# EAGLE design rk86-kbd (EAGLE 7.7.0)
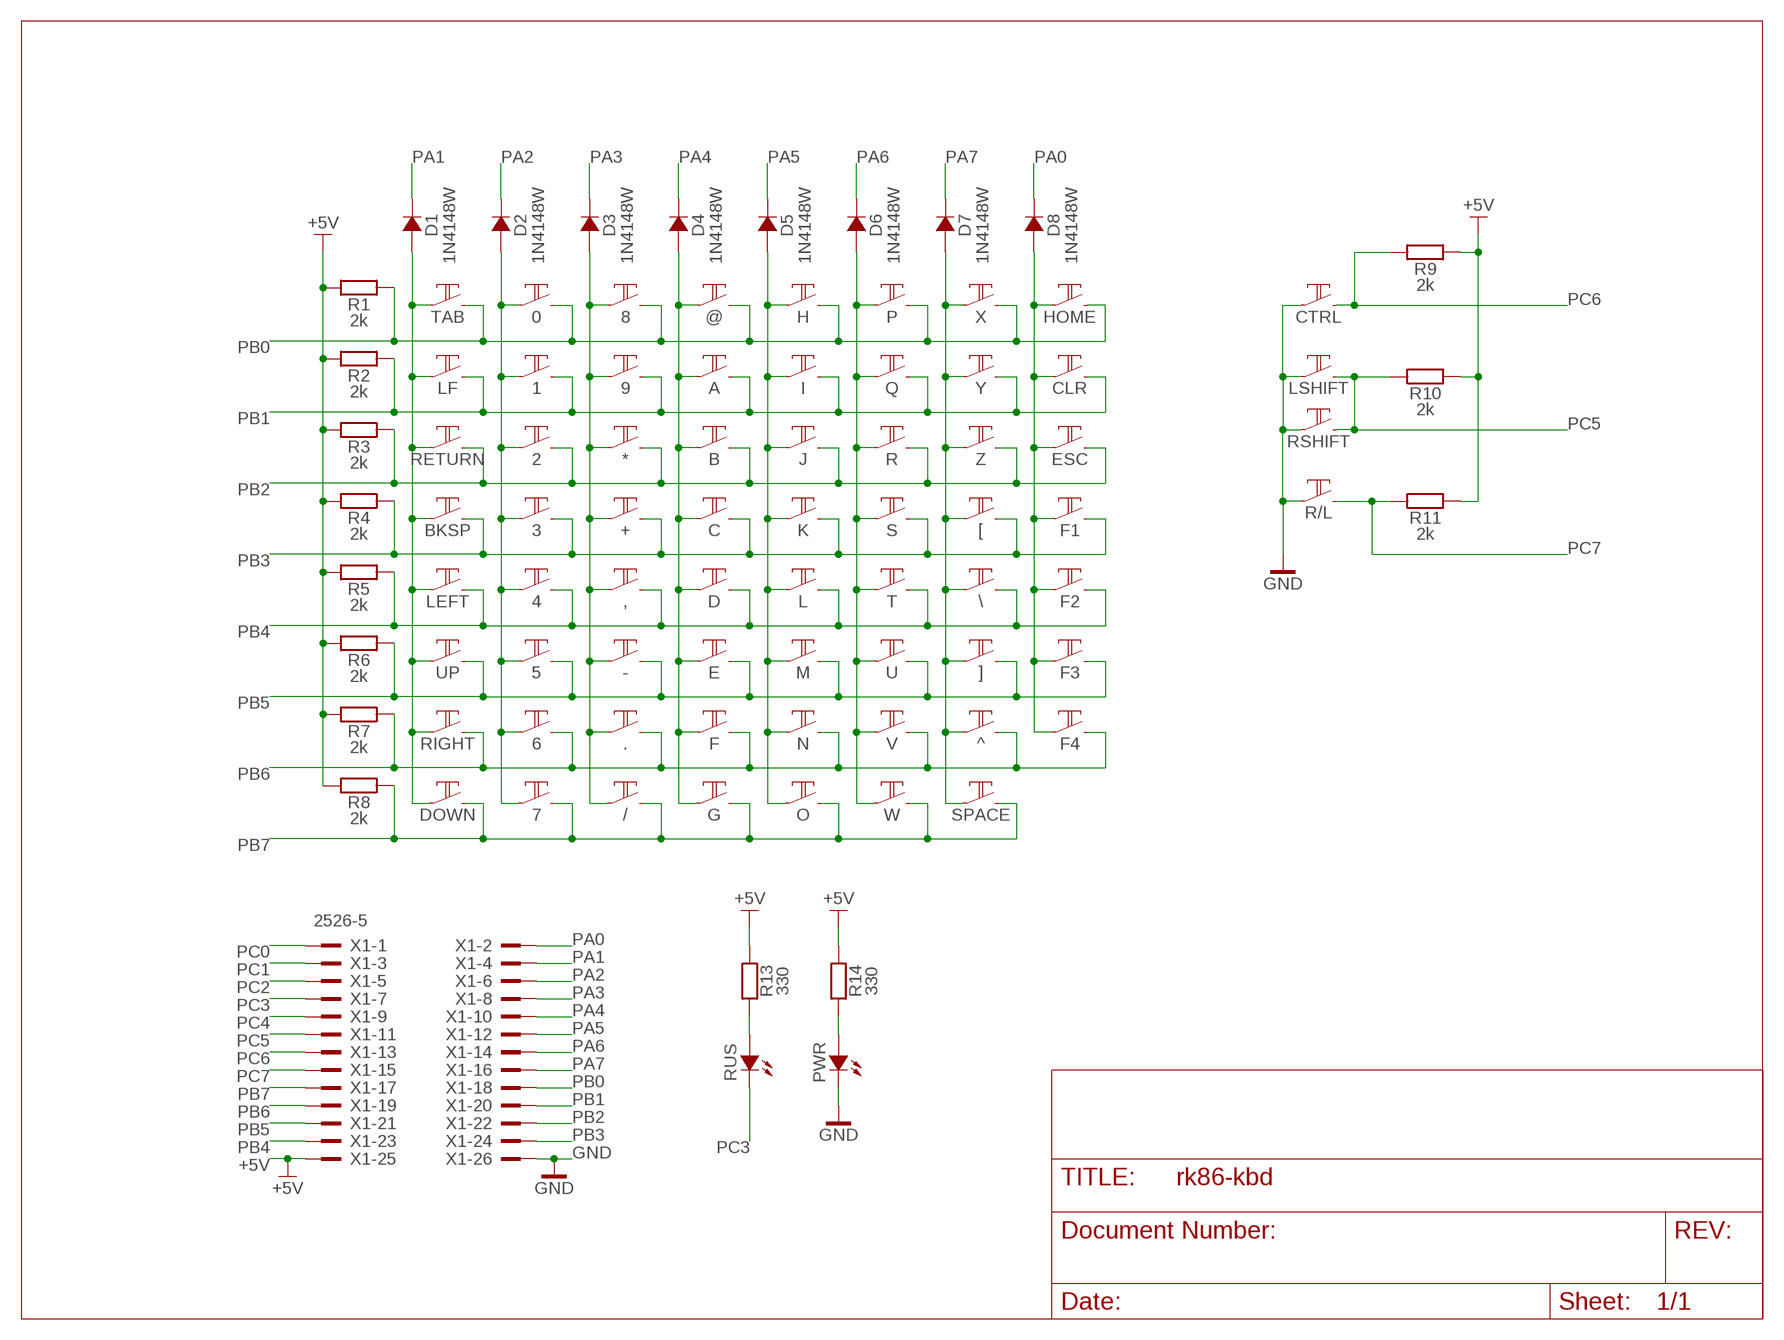
[diagram p0: schematic, sheet 1]

## Parts
0  TACT6S-15  [TACT_6X6_SMT_15]
1  TACT6S-15  [TACT_6X6_SMT_15]
2  TACT6S-15  [TACT_6X6_SMT_15]
3  TACT6S-15  [TACT_6X6_SMT_15]
4  TACT6S-15  [TACT_6X6_SMT_15]
5  TACT6S-15  [TACT_6X6_SMT_15]
6  TACT6S-15  [TACT_6X6_SMT_15]
7  TACT6S-15  [TACT_6X6_SMT_15]
8  TACT6S-15  [TACT_6X6_SMT_15]
9  TACT6S-15  [TACT_6X6_SMT_15]
*  TACT6S-15  [TACT_6X6_SMT_15]
+  TACT6S-15  [TACT_6X6_SMT_15]
,  TACT6S-15  [TACT_6X6_SMT_15]
-  TACT6S-15  [TACT_6X6_SMT_15]
.  TACT6S-15  [TACT_6X6_SMT_15]
/  TACT6S-15  [TACT_6X6_SMT_15]
@  TACT6S-15  [TACT_6X6_SMT_15]
[  TACT6S-15  [TACT_6X6_SMT_15]
\\  TACT6S-15  [TACT_6X6_SMT_15]
]  TACT6S-15  [TACT_6X6_SMT_15]
^  TACT6S-15  [TACT_6X6_SMT_15]
A  TACT6S-15  [TACT_6X6_SMT_15]
B  TACT6S-15  [TACT_6X6_SMT_15]
BKSP  TACT6S-15  [TACT_6X6_SMT_15]
C  TACT6S-15  [TACT_6X6_SMT_15]
CLR  TACT6S-15  [TACT_6X6_SMT_15]
CTRL  TACT6S-15  [TACT_6X6_SMT_15]
D  TACT6S-15  [TACT_6X6_SMT_15]
D1  1N4148W  [SOD123]
D2  1N4148W  [SOD123]
D3  1N4148W  [SOD123]
D4  1N4148W  [SOD123]
D5  1N4148W  [SOD123]
D6  1N4148W  [SOD123]
D7  1N4148W  [SOD123]
D8  1N4148W  [SOD123]
DOWN  TACT6S-15  [TACT_6X6_SMT_15]
E  TACT6S-15  [TACT_6X6_SMT_15]
ESC  TACT6S-15  [TACT_6X6_SMT_15]
F  TACT6S-15  [TACT_6X6_SMT_15]
F1  TACT6S-15  [TACT_6X6_SMT_15]
F2  TACT6S-15  [TACT_6X6_SMT_15]
F3  TACT6S-15  [TACT_6X6_SMT_15]
F4  TACT6S-15  [TACT_6X6_SMT_15]
G  TACT6S-15  [TACT_6X6_SMT_15]
H  TACT6S-15  [TACT_6X6_SMT_15]
HOME  TACT6S-15  [TACT_6X6_SMT_15]
I  TACT6S-15  [TACT_6X6_SMT_15]
J  TACT6S-15  [TACT_6X6_SMT_15]
K  TACT6S-15  [TACT_6X6_SMT_15]
L  TACT6S-15  [TACT_6X6_SMT_15]
LEFT  TACT6S-15  [TACT_6X6_SMT_15]
LF  TACT6S-15  [TACT_6X6_SMT_15]
LSHIFT  TACT6S-15  [TACT_6X6_SMT_15]
M  TACT6S-15  [TACT_6X6_SMT_15]
N  TACT6S-15  [TACT_6X6_SMT_15]
O  TACT6S-15  [TACT_6X6_SMT_15]
P  TACT6S-15  [TACT_6X6_SMT_15]
PWR  LED0805  [0805POL]
Q  TACT6S-15  [TACT_6X6_SMT_15]
R  TACT6S-15  [TACT_6X6_SMT_15]
R1  2k  RESISTOR0805  [0805]
R2  2k  RESISTOR0805  [0805]
R3  2k  RESISTOR0805  [0805]
R4  2k  RESISTOR0805  [0805]
R5  2k  RESISTOR0805  [0805]
R6  2k  RESISTOR0805  [0805]
R7  2k  RESISTOR0805  [0805]
R8  2k  RESISTOR0805  [0805]
R9  2k  RESISTOR0805  [0805]
R10  2k  RESISTOR0805  [0805]
R11  2k  RESISTOR0805  [0805]
R13  330  RESISTOR0805  [0805]
R14  330  RESISTOR0805  [0805]
R/L  TACT6S-15  [TACT_6X6_SMT_15]
RETURN  TACT6S-15  [TACT_6X6_SMT_15]
RIGHT  TACT6S-15  [TACT_6X6_SMT_15]
RSHIFT  TACT6S-15  [TACT_6X6_SMT_15]
RUS  LED0805  [0805POL]
S  TACT6S-15  [TACT_6X6_SMT_15]
SPACE  TACT6S-15  [TACT_6X6_SMT_15]
T  TACT6S-15  [TACT_6X6_SMT_15]
TAB  TACT6S-15  [TACT_6X6_SMT_15]
U  TACT6S-15  [TACT_6X6_SMT_15]
UP  TACT6S-15  [TACT_6X6_SMT_15]
V  TACT6S-15  [TACT_6X6_SMT_15]
W  TACT6S-15  [TACT_6X6_SMT_15]
X  TACT6S-15  [TACT_6X6_SMT_15]
X1  2526-5  [PAK100/2500-5-26]
Y  TACT6S-15  [TACT_6X6_SMT_15]
Z  TACT6S-15  [TACT_6X6_SMT_15]

## Nets
+5V: R1.1 R2.1 R3.1 R4.1 R5.1 R6.1 R7.1 R8.1 R9.2 R10.2 R11.2 R13.2 R14.2 X1.25
GND: CTRL.1(C) CTRL.2(C) LSHIFT.1(C) LSHIFT.2(C) PWR.K R/L.1(C) R/L.2(C) RSHIFT.1(C) RSHIFT.2(C) X1.26
N$1: R13.1 RUS.A
N$2: PWR.A R14.1
PA0: D8.K X1.2
PA0D: CLR.1(C) CLR.2(C) D8.A ESC.1(C) ESC.2(C) F1.1(C) F1.2(C) F2.1(C) F2.2(C) F3.1(C) F3.2(C) F4.1(C) F4.2(C) HOME.1(C) HOME.2(C)
PA1: D1.K X1.4
PA1D: BKSP.1(C) BKSP.2(C) D1.A DOWN.1(C) DOWN.2(C) LEFT.1(C) LEFT.2(C) LF.1(C) LF.2(C) RETURN.1(C) RETURN.2(C) RIGHT.1(C) RIGHT.2(C) TAB.1(C) TAB.2(C) UP.1(C) UP.2(C)
PA2: D2.K X1.6
PA2D: 0.1(C) 0.2(C) 1.1(C) 1.2(C) 2.1(C) 2.2(C) 3.1(C) 3.2(C) 4.1(C) 4.2(C) 5.1(C) 5.2(C) 6.1(C) 6.2(C) 7.1(C) 7.2(C) D2.A
PA3: D3.K X1.8
PA3D: 8.1(C) 8.2(C) 9.1(C) 9.2(C) *.1(C) *.2(C) +.1(C) +.2(C) ,.1(C) ,.2(C) -.1(C) -.2(C) ..1(C) ..2(C) /.1(C) /.2(C) D3.A
PA4: D4.K X1.10
PA4D: @.1(C) @.2(C) A.1(C) A.2(C) B.1(C) B.2(C) C.1(C) C.2(C) D4.A D.1(C) D.2(C) E.1(C) E.2(C) F.1(C) F.2(C) G.1(C) G.2(C)
PA5: D5.K X1.12
PA5D: D5.A H.1(C) H.2(C) I.1(C) I.2(C) J.1(C) J.2(C) K.1(C) K.2(C) L.1(C) L.2(C) M.1(C) M.2(C) N.1(C) N.2(C) O.1(C) O.2(C)
PA6: D6.K X1.14
PA6D: D6.A P.1(C) P.2(C) Q.1(C) Q.2(C) R.1(C) R.2(C) S.1(C) S.2(C) T.1(C) T.2(C) U.1(C) U.2(C) V.1(C) V.2(C) W.1(C) W.2(C)
PA7: D7.K X1.16
PA7D: [.1(C) [.2(C) \\.1(C) \\.2(C) ].1(C) ].2(C) ^.1(C) ^.2(C) D7.A SPACE.1(C) SPACE.2(C) X.1(C) X.2(C) Y.1(C) Y.2(C) Z.1(C) Z.2(C)
PB0: 0.3(NO) 0.4(NO) 8.3(NO) 8.4(NO) @.3(NO) @.4(NO) H.3(NO) H.4(NO) HOME.3(NO) HOME.4(NO) P.3(NO) P.4(NO) R1.2 TAB.3(NO) TAB.4(NO) X1.18 X.3(NO) X.4(NO)
PB1: 1.3(NO) 1.4(NO) 9.3(NO) 9.4(NO) A.3(NO) A.4(NO) CLR.3(NO) CLR.4(NO) I.3(NO) I.4(NO) LF.3(NO) LF.4(NO) Q.3(NO) Q.4(NO) R2.2 X1.20 Y.3(NO) Y.4(NO)
PB2: 2.3(NO) 2.4(NO) *.3(NO) *.4(NO) B.3(NO) B.4(NO) ESC.3(NO) ESC.4(NO) J.3(NO) J.4(NO) R3.2 R.3(NO) R.4(NO) RETURN.3(NO) RETURN.4(NO) X1.22 Z.3(NO) Z.4(NO)
PB3: 3.3(NO) 3.4(NO) +.3(NO) +.4(NO) [.3(NO) [.4(NO) BKSP.3(NO) BKSP.4(NO) C.3(NO) C.4(NO) F1.3(NO) F1.4(NO) K.3(NO) K.4(NO) R4.2 S.3(NO) S.4(NO) X1.24
PB4: 4.3(NO) 4.4(NO) ,.3(NO) ,.4(NO) \\.3(NO) \\.4(NO) D.3(NO) D.4(NO) F2.3(NO) F2.4(NO) L.3(NO) L.4(NO) LEFT.3(NO) LEFT.4(NO) R5.2 T.3(NO) T.4(NO) X1.23
PB5: 5.3(NO) 5.4(NO) -.3(NO) -.4(NO) ].3(NO) ].4(NO) E.3(NO) E.4(NO) F3.3(NO) F3.4(NO) M.3(NO) M.4(NO) R6.2 U.3(NO) U.4(NO) UP.3(NO) UP.4(NO) X1.21
PB6: 6.3(NO) 6.4(NO) ..3(NO) ..4(NO) ^.3(NO) ^.4(NO) F4.3(NO) F4.4(NO) F.3(NO) F.4(NO) N.3(NO) N.4(NO) R7.2 RIGHT.3(NO) RIGHT.4(NO) V.3(NO) V.4(NO) X1.19
PB7: 7.3(NO) 7.4(NO) /.3(NO) /.4(NO) DOWN.3(NO) DOWN.4(NO) G.3(NO) G.4(NO) O.3(NO) O.4(NO) R8.2 SPACE.3(NO) SPACE.4(NO) W.3(NO) W.4(NO) X1.17
PC0: X1.1
PC1: X1.3
PC2: X1.5
PC3: RUS.K X1.7
PC4: X1.9
PC5: LSHIFT.3(NO) LSHIFT.4(NO) R10.1 RSHIFT.3(NO) RSHIFT.4(NO) X1.11
PC6: CTRL.3(NO) CTRL.4(NO) R9.1 X1.13
PC7: R11.1 R/L.3(NO) R/L.4(NO) X1.15

## Library data of the parts
0 1-9 * + , - . / @ [ \\ ] ^ A B BKSP C CLR CTRL D DOWN E ESC F F1-F4 G H HOME I J K L LEFT LF LSHIFT M N O P Q R R/L RETURN RIGHT RSHIFT S SPACE T TAB U UP V W X Y Z = 1_eagle_lib:TACT: Tactile switch
D1-D8 = 1_eagle_lib:1N4148: 1N4148; 1N4448 High-speed diodes
PWR RUS = 1_eagle_lib:LED: LED
R1-R11 R13 R14 = 1_eagle_lib:RESISTOR: Vishay CMF Metal Film Resistors, Axial, Industrial, Precision
X1 = con-3m:2526-: 3M (TM) Pak 100 4-Wall Header Source: 3M; OC_FARNELL: 9838392; OC_NEWARK: unknown

## Board
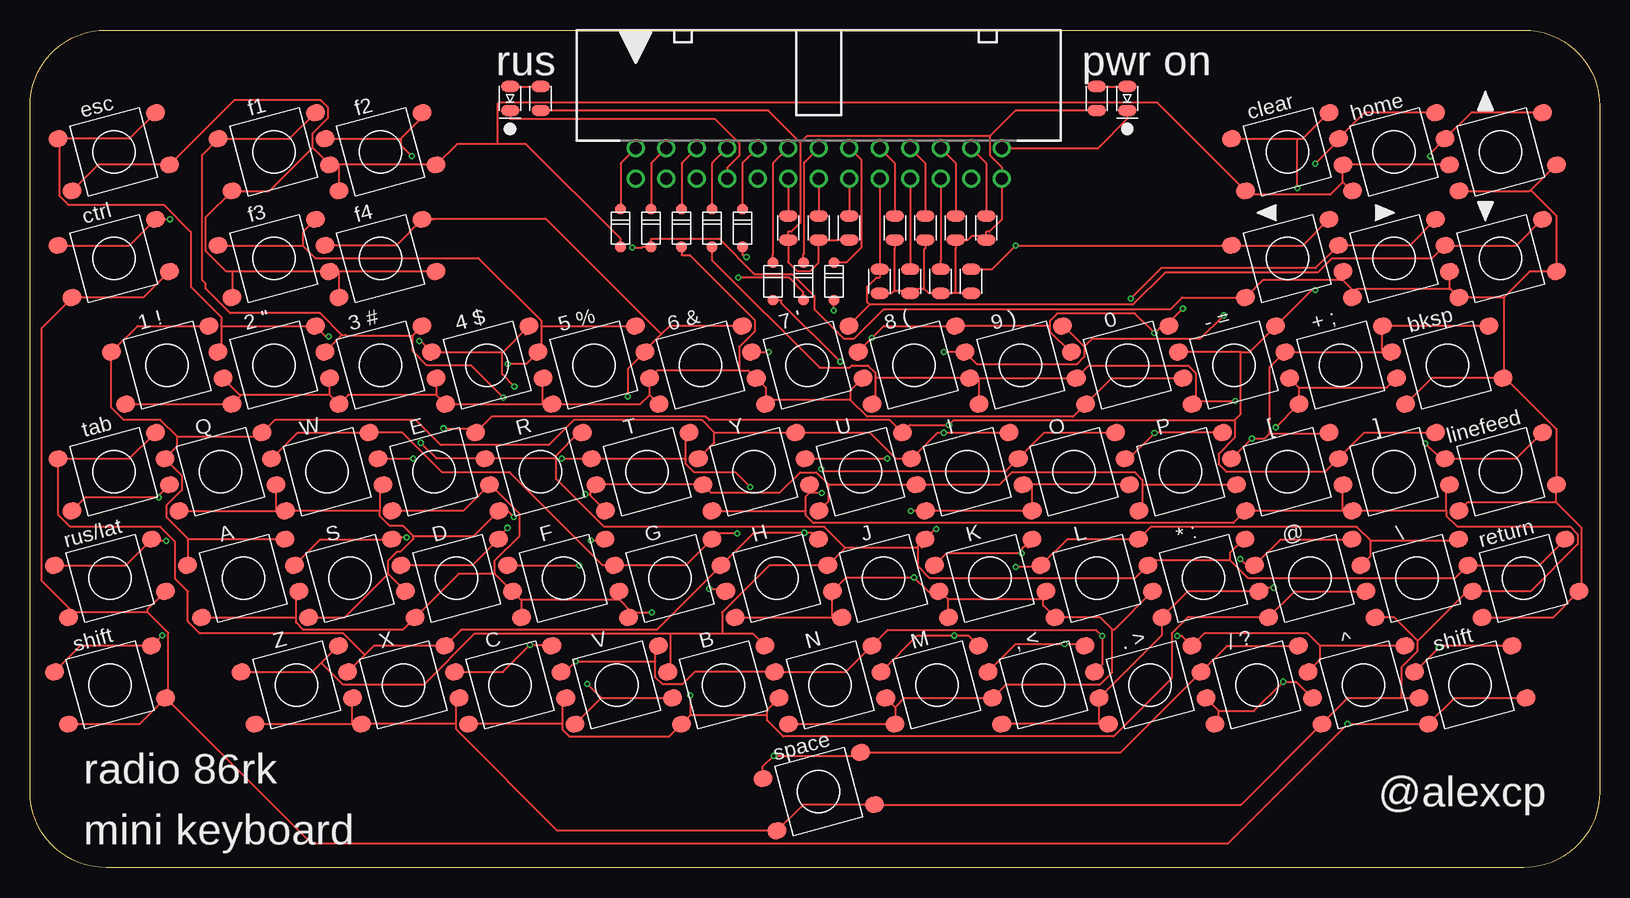
[diagram p1: board, top side]
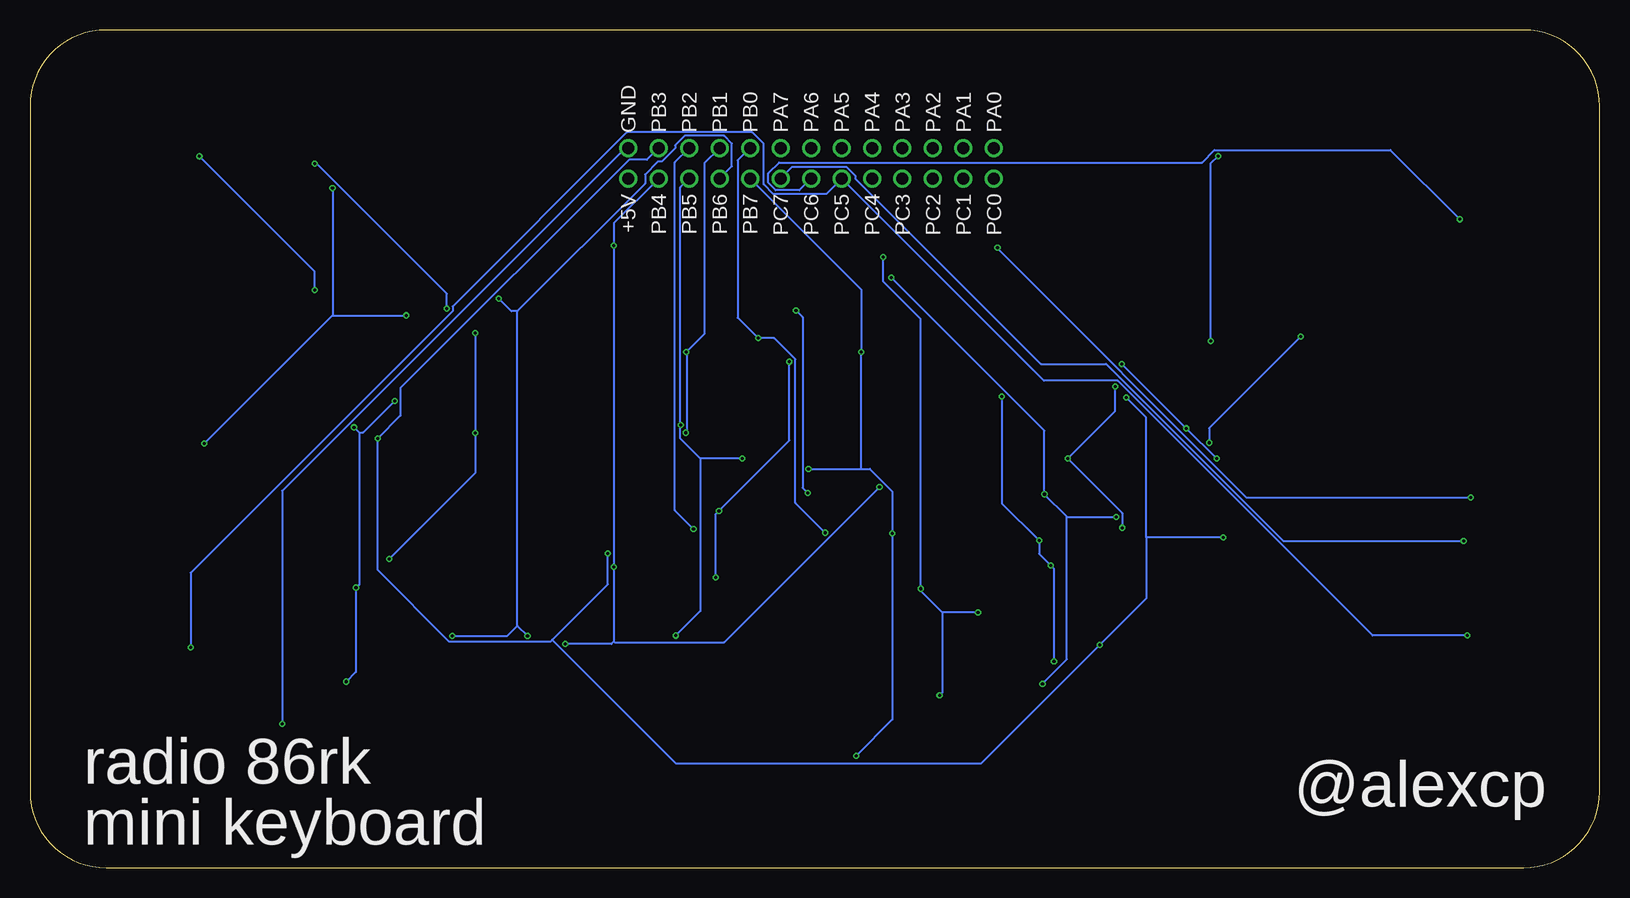
[diagram p2: board, bottom side, seen from below]

Size 130.81 x 69.85 mm. Coordinates in mm from the lower left corner, seen from the top.
Outline: 130.81,63.5 130.81,6.35 arc-90 124.46,0 6.35,0 arc-90 0,6.35 0,63.5 arc-90 6.35,69.85 124.46,69.85 arc-90 130.81,63.5
Copper layers (1*16): Top 0.035559375mm / dielectric 1.6mm / Bottom 0.035559375mm
Design rules "oshpark-2layer-tented": minimum track width 6mil, minimum drill 10mil, track to track 6mil, track to pad 6mil, pad to pad 6mil, via to via 6mil, smd to smd 6mil, copper to edge 15mil, drill to drill 6mil, minimum pad ring 5mil, minimum via ring 5mil, stop-mask expansion 2.5mil, vias tented up to drill 20mil, thermal gap 10mil

### Footprints (pad centres in the part's own frame; a part is rotated, then mirrored left to right if it is on the bottom)
TACT_6X6_SMT_15 = smd 1.6 x 1.4 rotated 15: 1 4.639,-1.086; 2 -3.475,-3.26; 3 3.475,3.26; 4 -4.639,1.086
SOD123 = smd 0.9 x 0.95: A -1.575,0; K 1.575,0
0805POL = smd 0.914 x 1.524: A -1.003,0; K 1.003,0
0805 = smd 0.914 x 1.524: 1 -1.003,0; 2 1.003,0
PAK100/2500-5-26 = drill 1 pad 1.422: 1 -15.24,-1.27; 2 -15.24,1.27; 3 -12.7,-1.27; 4 -12.7,1.27; 5 -10.16,-1.27; 6 -10.16,1.27; 7 -7.62,-1.27; 8 -7.62,1.27; 9 -5.08,-1.27; 10 -5.08,1.27; 11 -2.54,-1.27; 12 -2.54,1.27; 13 0,-1.27; 14 0,1.27; 15 2.54,-1.27; 16 2.54,1.27; 17 5.08,-1.27; 18 5.08,1.27; 19 7.62,-1.27; 20 7.62,1.27; 21 10.16,-1.27; 22 10.16,1.27; 23 12.7,-1.27; 24 12.7,1.27; 25 15.24,-1.27; 26 15.24,1.27

### Placement (x,y rotation side)
0  91.44,41.91 0 top
1  11.43,41.91 0 top
2  20.32,41.91 0 top
3  29.21,41.91 0 top
4  38.1,41.91 0 top
5  46.99,41.91 0 top
6  55.88,41.91 0 top
7  64.77,41.91 0 top
8  73.66,41.91 0 top
9  82.55,41.91 0 top
*  97.79,24.13 0 top
+  109.22,41.91 0 top
,  84.45,15.24 0 top
-  100.33,41.91 0 top
.  93.34,15.24 0 top
/  102.23,15.24 0 top
@  106.68,24.13 0 top
[  104.78,33.02 0 top
\\  115.57,24.13 0 top
]  113.67,33.02 0 top
^  111.12,15.24 0 top
A  17.78,24.13 0 top
B  57.78,15.24 0 top
BKSP  118.11,41.91 0 top
C  40.01,15.24 0 top
CLR  104.78,59.69 0 top
CTRL  6.99,50.8 0 top
D  35.56,24.13 0 top
D1  51.75,53.34 90 top
D2  54.29,53.34 90 top
D3  56.83,53.34 90 top
D4  59.37,53.34 90 top
D5  61.91,48.9 90 top
D6  64.45,48.9 90 top
D7  66.99,48.9 90 top
D8  49.21,53.34 90 top
DOWN  122.56,50.8 0 top
E  33.66,33.02 0 top
ESC  6.99,59.69 0 top
F  44.45,24.13 0 top
F1  20.32,59.69 0 top
F2  29.21,59.69 0 top
F3  20.32,50.8 0 top
F4  29.21,50.8 0 top
G  53.34,24.13 0 top
H  62.23,24.13 0 top
HOME  113.67,59.69 0 top
I  78.11,33.02 0 top
J  71.12,24.13 0 top
K  80.01,24.13 0 top
L  88.9,24.13 0 top
LEFT  104.78,50.8 0 top
LF  122.56,33.02 0 top
LSHIFT  120.02,15.24 0 top
M  75.56,15.24 0 top
N  66.67,15.24 0 top
O  87,33.02 0 top
P  95.89,33.02 0 top
PWR  91.44,64.14 270 top
Q  15.88,33.02 0 top
R  42.55,33.02 0 top
R1  72.07,53.34 90 top
R2  74.61,53.34 90 top
R3  77.15,53.34 90 top
R4  79.69,53.34 90 top
R5  78.42,48.9 90 top
R6  75.88,48.9 90 top
R7  73.34,48.9 90 top
R8  70.8,48.9 90 top
R9  65.72,53.34 270 top
R10  63.18,53.34 270 top
R11  68.26,53.34 270 top
R13  42.55,64.14 270 top
R14  88.9,64.14 270 top
R/L  6.67,24.13 0 top
RETURN  124.46,24.13 0 top
RIGHT  113.67,50.8 0 top
RSHIFT  6.67,15.24 0 top
RUS  40.01,64.14 270 top
S  26.67,24.13 0 top
SPACE  65.72,6.35 0 top
T  51.44,33.02 0 top
TAB  6.99,33.02 0 top
U  69.22,33.02 0 top
UP  122.56,59.69 0 top
V  48.9,15.24 0 top
W  24.77,33.02 0 top
X  31.11,15.24 0 top
X1  65.72,58.74 0 top
Y  60.33,33.02 0 top
Z  22.23,15.24 0 top

### Tracks (layer width: path | path; a pad name or v marks a point on that pad's centre or on a via)
+5V
  Top 0.152: R11.2 67.27,52.34 R9.2 65.72,50.46 65.01,49.74 63.93,49.74 63.18,50.49 R10.2 63.18,53.02 63.44,53.02 64.2,53.78 64.2,60.46 | 79.98,61 64.73,61 64.2,60.46 | 64.2,60.46 61.53,63.13 R13.2 | R8.1 71.79,47.89 71.97,48.06 72.07,48.06 | 73.34,48.06 72.07,48.06 | 72.07,48.06 72.07,51.65 R1.1 | 79.98,61 79.98,59.39 80.96,58.41 X1.25 | R14.2 82.12,63.13 79.98,61 | X1.25 80.96,54.03 79.95,53.02 79.69,53.02 79.69,52.65 | X1.25 | 74.49,48.3 74.42,48.23 73.34,48.23 73.34,48.06 | 74.49,48.3 74.49,51.52 74.61,51.65 R2.1 | 74.49,48.3 74.89,47.89 R6.1 76.07,47.89 76.87,47.89 77.15,47.89 | 77.15,47.89 77.93,47.89 R5.1 | 77.15,47.89 77.15,51.65 R3.1 78.14,52.34 78.46,52.65 79.69,52.65 | R4.1 79.69,52.65 | R7.1 73.34,48.06
GND  (via drill 0.25 pad 0.51)
  Top 0.152: LSHIFT.2 118.72,14.15 LSHIFT.1 | LSHIFT.2 v109.79,11.98 99.84,2.03 23.43,2.03 RSHIFT.1 | RSHIFT.2 9.13,11.98 RSHIFT.1 | RSHIFT.1 11.53,14.37 11.53,19.58 9.82,21.28 | 3.6,21.28 R/L.2 | 9.82,21.28 3.6,21.28 | 3.6,21.28 0.99,23.9 0.99,45.02 CTRL.2 | 9.82,21.28 9.82,21.56 R/L.1 | PWR.K 91.44,62.45 89,60.01 X1.26 | CTRL.1 9.45,47.54 CTRL.2 | CTRL.1 | CTRL.2 | RSHIFT.2 | R/L.2 | RSHIFT.1 | R/L.1 | LSHIFT.1 | LSHIFT.2
  Bottom 0.152: X1.26 81.2,60.01 109.79,31.42 v109.79,11.98
N$1
  Top 0.152: RUS.A R13.1
N$2
  Top 0.152: R14.1 PWR.A
PA0
  Top 0.152: X1.2 49.21,58.74 D8.K
PA0D
  Top 0.152: 17.14,56.43 F1.2 14.64,54.23 14.64,51.42 16.35,49.71 16.85,49.71 | 17.14,56.43 19.95,56.43 23.54,60.02 | 23.54,60.02 23.54,61.24 24.83,62.53 24.83,63.37 24.22,63.99 17.01,63.99 11.75,58.73 | 11.75,58.73 ESC.1 | F1.1 23.54,60.02 | 25.73,58.6 F1.1 | F2.1 25.73,58.6 | 25.73,58.6 F2.2 | ESC.1 5.68,58.6 3.7,56.62 | 3.7,56.62 ESC.2 3.7,56.62 | F3.1 24.77,49.71 | 24.77,49.71 16.85,49.71 | 16.85,49.71 F3.2 | 25.73,49.71 F3.1 | 33.66,49.71 F4.1 33.66,49.71 | 33.66,49.71 25.73,49.71 | 25.73,49.71 F4.2 | 109.41,57.16 CLR.1 | 109.41,57.16 110.14,56.43 HOME.2 | 109.41,57.16 108.36,56.1 101.63,56.1 CLR.2 | 38.96,60.34 35.58,60.34 F2.1 | 38.96,60.34 41.32,60.34 49.21,52.44 D8.A | 38.96,60.34 38.96,63.66 39.12,63.82 93.91,63.82 CLR.2 | HOME.1 109.86,58.6 | 109.86,58.6 CLR.1 | ESC.1 11.75,58.73 | F1.2 17.14,56.43 | F2.2 | F1.1 | F2.1 | F4.2 | F3.1 24.77,49.71 | CLR.2 | CLR.1 109.86,58.6 | HOME.1
PA1
  Top 0.152: X1.4 51.75,58.74 D1.K
PA1D  (via drill 0.25 pad 0.51)
  Top 0.152: 122.8,47.54 DOWN.2 | DOWN.1 124.97,49.71 122.8,47.54 | 122.8,47.54 122.8,40.87 | 122.8,40.87 122.91,40.87 127.19,36.59 LF.1 | 122.8,40.87 BKSP.1 | LEFT.2 96.02,47.54 95.05,46.57 71.14,46.57 68.69,44.12 67.8,44.12 65.36,46.57 65.36,47.67 63.52,49.5 60.37,49.5 57.43,52.44 51.75,52.44 D1.A 51.05,51.77 50.99,51.71 v50.18,51.71 | 125.07,56.48 127.19,54.35 DOWN.1 | 109.41,48.98 102.74,48.98 LEFT.2 | BKSP.1 116.81,40.82 BKSP.2 | TAB.1 10.73,31.04 v10.73,30.86 4.62,30.86 TAB.2 | 110.35,48.05 109.41,48.98 | 118.3,48.23 110.52,48.23 110.35,48.05 | 110.35,48.05 110.35,47.7 RIGHT.2 | 109.41,48.98 LEFT.1 | 127.19,30.44 119.76,30.44 LF.2 | RETURN.1 129.3,23.25 129.3,28.33 127.19,30.44 | 127.19,30.44 127.19,31.75 | 127.19,31.75 LF.1 | RETURN.2 121.28,20.87 | 121.28,20.87 126.92,20.87 128.91,22.86 | 128.91,22.86 RETURN.1 | 125.07,56.48 125.01,56.48 124.96,56.43 UP.2 | 125.07,56.48 | 125.07,56.48 UP.1 | DOWN.2 118.39,48.23 118.3,48.23 | 118.3,48.23 118.3,49.53 | 118.3,49.53 RIGHT.1 118.3,49.53 | TAB.2 | TAB.1 | RETURN.1 128.91,22.86 | RETURN.2 121.28,20.87 | UP.1 | DOWN.1 | DOWN.2 | LEFT.1 | LEFT.2 | LF.1 127.19,31.75 | BKSP.1 | BKSP.2
  Bottom 0.152: v50.18,51.71 50.18,51.6 29.44,30.86 v10.73,30.86
PA2
  Top 0.152: X1.6 54.29,58.74 D2.K
PA2D
  Top 0.152: 33.85,39.43 4.2 34.92,38.65 | 33.85,40.64 3.1 33.85,40.64 | 33.85,40.64 33.85,39.43 | 33.85,39.43 26.51,39.43 3.2 | 3.2 24.96,39.43 | 34.92,38.65 42.74,38.65 | 0.2 86.93,37.61 69.75,37.61 68.35,39.01 | 6.1 61.3,40.05 7.2 | 59.09,41.47 59.87,41.47 6.1 | 0.2 90.14,40.82 0.1 | 7.1 68.35,39.77 68.35,39.01 | 68.35,39.01 61.66,39.01 7.2 | 51.63,39.43 5.1 | 6.2 52.2,38.86 | 52.2,38.86 51.63,39.43 | 5.2 50.85,38.65 51.63,39.43 | 42.74,38.65 5.2 | 59.09,41.47 52.28,41.47 5.1 | 59.09,41.47 59.09,43.41 60.38,44.71 60.38,45.67 54.97,51.09 54.29,51.09 D2.A | 42.74,38.65 42.74,40.64 | 42.74,40.64 4.1 42.74,40.64 | 8.26,38.65 1.2 8.26,38.65 | 8.26,38.65 2.2 | 17.47,39.43 1.1 | 24.96,39.43 17.47,39.43 | 17.47,39.43 17.47,39.27 2.2 | 24.96,39.43 2.1 | 2.2 | 3.2 | 4.2 34.92,38.65 | 5.2 | 0.1 | 0.2 | 7.1 | 6.1 | 7.2 | 6.2 52.2,38.86 | 5.1 | 2.1 | 1.1
PA3
  Top 0.152: X1.8 56.83,58.74 D3.K
PA3D  (via drill 0.25 pad 0.51)
  Top 0.152: 97.13,38.93 v100.42,38.93 | 97.13,38.93 -.2 | 9.1 88.22,41.86 96.52,41.86 97.13,41.25 97.13,38.93 | D3.A 56.83,50.66 65.79,41.7 68.31,41.7 68.49,41.89 69.83,41.89 70.44,41.28 70.44,40.82 | v103.81,36.72 v103.82,36.72 105.62,38.52 | 105.62,38.52 +.2 105.75,40.05 | 70.44,40.82 70.44,38.9 8.2 | 8.1 70.44,40.82 | 79.08,40.82 8.1 | /.1 105.51,15.52 v104.44,15.52 102,13.07 99.07,13.07 | v103.64,23.35 102.73,23.35 *.1 | *.2 94.32,19.38 ,.1 | *.1 102.23,23.04 | 102.23,23.04 96.49,23.04 *.2 | 79.08,40.82 87,40.82 | 87,40.82 9.1 | -.1 105.75,40.05 | 105.75,40.05 113.08,40.05 +.1 | 89.09,11.98 ,.2 | 89.09,11.98 ..2 | 89.09,11.98 89.09,13.97 | 89.09,13.97 ,.1 | 99.07,13.07 98.3,13.84 | 98.3,13.84 ..1 98.3,13.84 | /.2 99.07,12.29 99.07,13.07 | 79.08,40.82 9.2 | +.1 | +.2 105.62,38.52 | -.1 | *.1 102.23,23.04 | *.2 | 9.1 87,40.82 | 8.1 | ,.1 89.09,13.97 | /.2 | /.1
  Bottom 0.152: 103.39,36.31 103.04,36.31 v100.42,38.93 | 103.39,36.31 103.39,23.6 v103.64,23.35 103.64,16.32 v104.44,15.52 | v103.81,36.72 103.39,36.31
PA4
  Top 0.152: X1.10 59.37,58.74 D4.K
PA4D  (via drill 0.25 pad 0.51)
  Top 0.152: 61.43,12.73 61.43,13.16 B.1 | @.2 96.48,20.87 95.13,19.52 95.13,15.79 90.3,10.95 62.76,10.95 61.43,12.27 61.43,12.73 | 55.02,12.73 61.43,12.73 | 55.02,12.73 55.02,12.68 B.2 | v55.02,14.37 55.02,12.73 | 40.98,22.37 49.09,22.37 | D.1 40.88,22.37 40.98,22.37 | F.2 40.98,22.37 | 49.09,22.37 F.1 | 50.16,21.29 49.09,22.37 | G.2 50.16,21.17 50.16,21.29 | 50.16,21.29 v51.81,21.29 | v59.71,50.9 59.52,51.09 59.37,51.09 D4.A | E.1 36.12,29.76 E.2 | 38.75,24.5 38.75,25.63 40.8,27.68 40.8,29.51 38.65,31.66 | 38.65,31.66 38.37,31.93 E.1 | v56.59,23.27 57.76,23.27 G.1 | 22.17,20.87 22.17,22.79 A.1 | D.2 31.06,19.84 22.76,19.84 22.17,20.44 22.17,20.87 | 22.17,20.87 A.2 | 38.75,24.5 35.71,24.5 D.2 | 38.75,24.5 D.1 | 44.37,11.98 44.37,11.54 44.96,10.95 53.28,10.95 B.2 | C.1 44.37,13.88 44.37,11.98 | 44.37,11.98 C.2 | @.2 105.38,23.04 111.12,23.04 | 111.12,23.04 @.1 | A.1 | E.1 38.65,31.66 | D.1 | F.2 | C.1 | D.2 | E.2 | @.1 111.12,22.86 | 111.12,23.04 @.1 | @.2 | G.1 | G.2 | F.1 | B.2 | B.1
  Bottom 0.152: 54.8,21.29 56.59,23.08 v56.59,23.27 56.59,45.75 59.71,48.87 v59.71,50.9 | v51.81,21.29 54.8,21.29 | 54.8,21.29 54.8,14.58 v55.02,14.37
PA5
  Top 0.152: D5.K 61.91,51.15 61.91,58.74 X1.12
PA5D  (via drill 0.25 pad 0.51)
  Top 0.152: v67.53,42.19 62.62,47.09 62.62,47.32 D5.A | H.1 68.04,24.21 v73.67,24.21 74.83,23.04 75.56,23.04 | 75.56,23.04 J.1 | O.2 I.2 | I.2 74.3,29.76 | 74.3,29.76 v73.39,29.76 | 66.87,20.87 J.2 | 59.05,20.87 H.2 59.05,20.87 | 59.05,20.87 66.87,20.87 | 66.87,20.87 66.87,22.86 | 66.87,22.86 H.1 | 84.44,22.38 84.44,22.83 84.46,22.86 | 84.46,22.86 K.1 84.46,22.86 | L.2 84.44,21.86 84.44,22.38 | 84.44,22.38 76.53,22.38 | 76.53,22.38 75.87,23.04 J.1 | K.2 76.53,22.38 | 90.19,19.89 89.21,20.87 L.2 | 83.52,31.93 83.19,31.93 | 83.19,31.93 I.1 83.19,31.93 | O.1 83.52,31.93 | O.2 83.52,31.93 | M.1 81.34,15.29 89.18,15.29 90.19,16.29 90.19,19.89 | 72.09,13.38 72.87,14.15 M.1 | 90.19,19.89 90.39,19.89 L.1 | 72.09,13.38 M.2 71.75,11.98 | 71.63,13.84 N.1 71.63,13.84 | 71.63,13.84 72.09,13.38 | N.2 71.75,11.98 | L.1 | O.1 | O.2 | L.2 | K.2 | J.1 75.56,23.04 | I.2 74.3,29.76 | H.1 66.87,22.86 | J.2 | N.2 | M.2 71.75,11.98 | M.1
  Bottom 0.152: v67.53,42.19 67.53,35.63 v73.39,29.76 73.67,29.49 v73.67,24.21
PA6
  Top 0.152: D6.K 64.45,51.15 64.5,51.2 64.5,58.79 X1.14
PA6D  (via drill 0.25 pad 0.51)
  Top 0.152: T.1 56.74,31.27 62.48,31.27 64.18,32.97 65.53,32.97 66.56,31.93 | 65.93,29.95 U.2 65.93,29.95 | 65.93,29.95 66.56,30.58 66.56,31.93 | 66.56,31.93 U.1 | v59.03,49.2 63.25,49.2 64.45,48 D6.A | v40.3,29.26 39.8,29.76 R.2 38.63,29.32 | 31.95,27.65 31.1,28.5 29.97,28.5 29.15,29.32 29.15,29.76 | 29.85,24.5 29.85,25.62 30.59,26.36 30.88,26.36 31.95,27.43 31.95,27.65 | 31.95,27.65 36.96,27.65 38.63,29.32 | T.1 R.1 | 46.67,31.14 46.67,31.05 T.2 | R.1 46.67,31.42 46.67,31.14 | 46.67,31.14 v46.27,31.14 | 29.85,24.5 S.1 | S.2 26.21,20.87 29.85,24.5 | W.1 29.15,31.68 29.15,29.76 | 29.15,29.76 W.2 | 20.51,29.76 W.2 | Q.2 20.51,29.76 | 20.51,29.76 Q.1 | 92.7,31.93 92.7,30.05 P.2 | U.1 74.3,31.93 | 74.3,31.93 80.8,31.93 81.84,32.98 92.05,32.98 92.7,32.33 92.7,31.93 | 92.7,31.93 P.1 | 47.53,14.15 47.53,14.09 V.2 | v46.44,15.35 47.53,14.25 47.53,14.15 | 47.53,14.15 V.1 | Q.2 | S.2 | W.2 | Q.1 | R.2 38.63,29.32 | V.2 | S.1 | W.1 | P.1 | P.2 | U.1 74.3,31.93 | T.1 | R.1 | V.1
  Bottom 0.152: v59.03,49.2 46.27,36.44 v46.27,31.14 44.4,29.27 44.4,29.26 | 44.4,29.26 v40.3,29.26 | v46.44,15.35 44.4,17.38 44.4,29.26
PA7
  Top 0.152: X1.16 69.25,59.02 69.25,51.7 68.03,50.47 D7.K
PA7D  (via drill 0.25 pad 0.51)
  Top 0.152: 114.31,14.15 ^.1 | ^.2 109.83,14.15 114.31,14.15 | 114.31,14.15 114.31,16.74 115.65,18.08 115.65,18.93 | 115.65,18.93 113.7,20.87 \\.2 | \\.1 120.02,23.04 | 120.02,23.04 119.76,23.04 115.65,18.93 | SPACE.1 70.48,5.26 | 70.48,5.26 100.94,5.26 107.21,11.54 | 107.21,11.54 ^.2 | 64.65,29.76 64.65,30.97 64.96,31.29 | [.2 100.27,28.73 65.29,28.73 64.65,29.37 64.65,29.76 | Y.2 64.65,29.76 | 109.41,29.76 [.2 | 64.96,31.29 65.93,31.29 v65.98,31.24 | 64.96,31.75 Y.1 64.96,31.75 | 64.96,31.75 64.96,31.29 | v66.98,46.46 66.99,46.48 D7.A | 118.03,29.76 118.03,29.35 118.94,28.44 128.34,28.44 129,27.78 129,26.98 125.06,23.04 \\.1 | SPACE.2 61.59,3.09 | 61.59,3.09 43.95,3.09 35.5,11.54 35.5,11.98 | 109.86,29.76 ].2 118.03,29.76 | 109.86,29.76 109.41,29.76 | 109.41,29.76 109.41,31.75 | 109.41,31.75 [.1 109.41,31.75 | 118.03,29.76 118.03,31.66 ].1 | SPACE.1 64.42,5.26 SPACE.2 | 26.86,11.98 27.3,11.98 | 27.3,11.98 X.2 | Z.2 26.86,11.98 | 26.86,11.98 Z.1 | 35.5,11.98 35.5,13.9 X.1 | 35.5,11.98 X.2 | Z.2 | X.2 27.3,11.98 | Z.1 | X.1 | \\.1 120.02,23.04 | ].1 | ].2 109.86,29.76 | [.2 | Y.2 | ^.2 107.21,11.54 | ^.1 | SPACE.1 70.48,5.26 | SPACE.2 61.59,3.09
  Bottom 0.152: v66.98,46.46 66.42,45.9 66.42,31.67 v65.98,31.24
PB0  (via drill 0.25 pad 0.51)
  Top 0.152: 27.9,17.75 X.4 | X.3 28.65,18.5 27.9,17.75 | 27.9,17.75 26.12,19.54 14.15,19.54 13.15,20.54 13.15,23.04 12.09,24.09 12.09,27.18 10.86,28.42 3.36,28.42 2.35,29.43 TAB.4 | H.4 52.22,19.84 35.93,19.84 X.3 | @.4 101.39,25.22 v100.86,25.75 | 0.3 94.92,45.45 | 94.92,45.45 v96.08,46.61 | 0.3 94.32,45.17 v93.71,44.56 92.07,46.2 85.6,46.2 85,45.6 85,45.17 | v107.09,58.69 109.03,60.62 HOME.4 | 8.3 71.15,45.17 v70.14,44.16 69.19,43.21 | X1.18 72.07,58.74 R1.2 | 85,45.17 8.3 | 69.19,43.21 69.02,43.04 8.4 69.19,43.21 | H.4 60.31,27.93 v64.54,27.93 65.16,27.93 H.3 | TAB.4 8.29,34.11 10.27,36.09 | 10.27,36.09 TAB.3 10.27,36.09 | @.4 102.23,25.41 | 102.23,25.41 104.22,27.39 109.86,27.39 | 109.86,27.39 @.3 | P.4 91.56,34.11 v93.71,36.26 93.73,36.28 P.3 | 85,45.17 85,44.72 86.72,43 0.4 | HOME.4 111.2,62.95 HOME.3 | TAB.4 | X.4 | X.3 | HOME.4 | @.3 109.86,27.39 | 0.3 94.92,45.45 | @.4 102.23,25.41 | P.4 | 0.4 | 8.3 | H.4
  Bottom 0.152: v100.86,25.75 93.71,32.9 v93.71,36.26 v93.71,44.56 | v64.54,27.93 67.04,30.43 67.04,42.39 68.8,44.16 v70.14,44.16 71.83,45.85 71.83,58.98 X1.18 | v96.08,46.61 96.08,47.86 106.91,58.69 v107.09,58.69
PB1  (via drill 0.25 pad 0.51)
  Top 0.152: 13.21,27.39 13.14,27.32 13.14,25.4 | 13.14,25.4 A.4 13.14,25.4 | A.3 13.21,27.39 | Q.4 12.65,32.69 12.65,31.48 11.37,30.19 11.37,29.23 13.21,27.39 | Q.4 12.28,35.15 12.28,35.94 | I.4 75.62,36.27 v76.15,36.27 81.56,36.27 | I.3 81.56,36.27 | 9.4 v76.13,43 | 87.86,43.48 87.86,42.6 87.23,41.97 78.94,41.97 9.4 | 57.03,36.28 56,37.31 45.3,37.31 43.22,35.23 34.24,35.23 32.16,37.31 20.38,37.31 Q.3 19.16,36.09 | 1.4 6.98,43.19 | 6.98,43.19 8.96,45.17 1.3 | 12.28,35.94 10.87,37.35 7.8,37.35 6.79,38.35 1.4 | Y.3 69.98,36.28 72.15,34.11 73.03,34.11 | 73.03,34.11 I.4 | 57.03,36.28 Y.3 | v116.28,35.38 117.55,34.11 LF.4 | 105.6,60.78 106.08,60.78 CLR.3 | CLR.4 105.6,60.78 | v105.6,56.66 105.6,60.78 | v99.47,46.05 97.49,44.08 88.47,44.08 87.86,43.48 | 9.3 86.17,45.17 87.86,43.48 | X1.20 74.61,58.74 R2.2 | Y.4 57.03,35.45 57.03,36.28 | 12.28,35.94 19.01,35.94 19.16,36.09 | LF.4 123.86,34.11 LF.3 | Q.4 | A.3 | Q.3 19.16,36.09 | CLR.4 | LF.4 | 9.3 | 9.4 | I.3 81.56,36.27 | I.4 73.03,34.11 | Y.3 | Y.4 | 1.4 6.98,43.19 | 1.3
  Bottom 0.152: X1.20 74.61,58.74 74.61,44.51 v76.13,43 76.1,42.97 76.1,36.32 v76.15,36.27 | 105.6,46.05 v99.47,46.05 | v105.6,56.66 105.6,46.05 | 105.6,46.05 105.61,46.05 v116.28,35.38
PB2  (via drill 0.25 pad 0.51)
  Top 0.152: R.4 37.47,34.11 | 37.47,34.11 33.88,34.11 v32.55,35.43 | v24.91,44.3 24.66,44.3 24,44.96 | 24,44.96 2.3 15.93,45.17 | 43.84,34.11 R.4 | 43.84,34.11 43.84,34.38 45.75,36.28 R.3 | 67.94,26.68 66.2,28.42 47.84,28.42 43.84,32.41 43.84,34.11 | 73.98,26.68 73.98,25.15 74.94,24.18 92.11,24.18 *.4 | 73.98,26.68 73.98,26.77 J.3 74.72,27.52 | 73.98,26.68 67.94,26.68 | 67.94,26.68 66.67,25.41 | 66.67,25.41 J.4 | 15.93,45.17 15.93,43.25 15.87,43.19 | 15.87,43.19 2.4 15.87,43.19 | 2.43,60.78 2.43,56.04 3.18,55.28 11.13,55.28 13.4,53.01 13.4,48.46 15.93,45.93 15.93,45.17 | 2.43,60.78 ESC.4 | ESC.3 8.29,60.78 2.43,60.78 | 53.4,19.53 57.68,19.53 | 24.27,17.07 26.05,15.29 32.84,15.29 37.07,19.53 53.4,19.53 | B.4 53.4,16.58 53.4,19.53 | 57.68,19.53 60.23,19.53 B.3 | J.4 61.61,25.22 57.68,21.29 57.68,19.53 | 24.27,17.07 Z.3 | Z.4 23.52,16.33 24.27,17.07 | 100,25.65 101.47,24.18 118.78,24.18 RETURN.4 | *.4 93.58,25.65 100,25.65 | *.3 101.16,27.39 | 101.16,27.39 100,26.23 100,25.65 | X1.22 77.15,58.74 R3.2 | 74.72,27.52 75.45,28.24 v75.52,28.24 | RETURN.4 120.02,25.22 | 120.02,25.22 125.76,25.22 RETURN.3 | ESC.4 | ESC.3 | Z.4 | Z.3 | R.3 | R.4 37.47,34.11 | RETURN.4 120.02,25.22 | *.3 101.16,27.39 | *.4 | J.3 74.3,26.67 74.72,27.52 | J.4 66.67,25.41 | 2.3 24,44.96 | B.4 | B.3
  Bottom 0.152: v24.91,44.3 32.55,36.66 v32.55,35.43 | v75.52,28.24 77.07,29.79 77.07,58.82 X1.22
PB3  (via drill 0.25 pad 0.51)
  Top 0.152: 103.32,36.22 103.32,41.73 +.4 | 103.32,36.22 102.9,35.8 v101.83,35.8 [.4 | 103.32,36.22 108.19,36.22 | 108.19,36.22 [.3 | v39.45,39.2 36.76,41.89 33.08,41.89 31.9,43.06 31.9,44.39 | 31.9,44.39 32.17,44.66 | 32.17,44.66 3.3 | 26,44.42 26.29,44.42 26.32,44.39 31.9,44.39 | F1.4 21.62,60.78 F1.3 | 26,44.42 24.18,46.24 16.68,46.24 14.64,48.27 14.64,48.71 14.34,49.01 14.34,59.43 F1.4 | F1.4 | 3.4 26,44.42 | v31.38,27.54 30.29,27.54 S.3 | C.4 39.4,16.33 v41.67,18.59 43.39,18.59 C.3 | 75.56,25.41 76.36,26.21 v82.66,26.21 82.66,26.56 82.97,26.88 | 75.56,25.41 K.4 75.56,25.41 | X1.24 79.69,58.74 R4.2 | K.3 82.97,26.88 | 121.28,45.17 BKSP.3 121.28,45.17 | 121.28,45.17 +.3 | 112.69,43 BKSP.4 | +.4 104.78,43 | 104.78,43 112.69,43 | 112.69,43 112.69,44.45 | 112.69,44.45 +.3 | S.4 24.2,27.39 S.3 | F1.4 | S.4 | C.3 | C.4 | S.3 | +.3 112.69,44.45 | BKSP.4 | [.3 108.19,36.22 | +.4 104.78,43 | [.4 | K.3 83.19,26.67 82.97,26.88 | 3.3 32.17,44.66 | 3.4
  Bottom 0.152: X1.24 79.4,59.03 80.89,59.03 99.94,39.98 99.94,37.69 v101.83,35.8 101.83,24.81 95.85,18.84 87.45,18.84 87.29,19 | 37.8,27.54 37.8,22.45 v41.67,18.59 51.55,8.7 76.99,8.7 87.29,19 | v31.38,27.54 37.8,27.54 | 37.8,27.54 37.8,37.55 v39.45,39.2 | 87.29,19 82.66,23.64 v82.66,26.21
PB4  (via drill 0.25 pad 0.51)
  Top 0.152: 54.66,34.11 54.66,35.56 | 54.66,35.56 54.66,36.03 T.3 54.66,35.56 | T.4 54.66,34.11 | v60.02,31.75 58.81,32.96 55.37,32.96 54.66,33.68 54.66,34.11 | v44.33,34.11 46.35,34.11 | 46.35,34.11 T.4 | 4.4 39.27,43 39.33,42.93 | v32.42,43.91 32.55,43.91 4.4 | 39.33,42.93 4.3 | v40.37,40.12 39.33,41.16 39.33,42.93 | v39.79,28.35 39.03,27.59 D.3 | 30.89,60.78 30.89,60.26 v31.8,59.34 | ,.4 82.15,18.66 v86.21,18.66 87.77,18.66 ,.3 | 92.08,27.39 L.3 93.41,28.43 110.58,28.43 111.71,27.29 | 92.08,27.39 86.44,27.39 84.45,25.41 | 84.45,25.41 L.4 | L.4 84.13,25.08 v82.16,25.08 | 111.71,27.29 118.75,27.29 | 118.75,27.29 118.94,27.29 \\.3 | \\.4 111.71,26 111.71,27.29 | LEFT.4 106.08,51.89 LEFT.3 | LEFT.4 v82.16,51.89 80.17,49.9 R5.2 | 30.89,60.78 32.68,62.57 F2.3 | F2.4 30.89,60.78 | D.3 36.86,25.22 D.4 | F2.4 | D.3 | D.4 | LEFT.4 | \\.3 118.75,27.29 | \\.4 | L.3 92.08,27.39 | L.4 84.45,25.41 | 4.3 41.27,44.45 4.3 | 4.4 | T.4 46.35,34.11 | ,.4 | ,.3
  Bottom 0.152: 82.16,18.87 82.08,18.8 72.97,18.8 v60.02,31.75 | 82.16,18.87 82.37,18.66 v86.21,18.66 | 82.16,18.87 v82.16,25.08 v82.16,51.89 82.16,53.73 X1.23 | v40.37,40.12 40.37,38.06 v44.33,34.11 39.79,29.57 v39.79,28.35 | v32.42,43.91 32.42,58.73 v31.8,59.34
PB5  (via drill 0.25 pad 0.51)
  Top 0.152: E.4 v31.93,34.11 | v116.69,59.31 116.69,59.55 117.79,60.65 | 117.79,60.65 UP.4 | -.3 103.93,45.3 | 103.93,45.3 106.8,48.17 v107.09,48.17 | 100.91,43 101.63,43 -.3 | ].4 111.2,36.28 ].3 | 100.39,37.31 100.91,37.83 100.91,43 | 100.39,37.31 76.97,37.31 v76.58,36.92 73.33,36.92 U.3 | 100.39,37.31 100.39,35.85 99.05,34.51 99.05,33.66 99.68,33.02 107.94,33.02 ].4 | 100.91,43 -.4 | M.4 73.95,19.35 v77.01,19.35 78.19,19.35 M.3 | U.4 v71.45,34.11 | 5.4 41.35,42 v39.82,42 | 42.6,45.17 42.6,43.25 42.54,43.19 | 42.54,43.19 5.4 | 22.75,51.89 23.79,50.84 37.36,50.84 42.6,45.6 42.6,45.17 | 42.6,45.17 50.16,45.17 | 50.16,45.17 5.3 50.16,45.17 | 22.75,51.89 22.75,53.01 F3.3 | F3.4 22.75,51.89 | U.3 71.66,37.31 56.59,37.31 56.28,37.61 38.46,37.61 E.3 | v34.46,36.64 36.77,36.64 E.3 | UP.4 120.09,62.95 UP.3 | X1.21 75.88,50.58 R6.2 | F3.4 | E.3 | E.4 | UP.4 117.79,60.65 | ].4 | -.3 103.93,45.3 | -.4 | U.3 | U.4 | 5.4 42.54,43.19 | M.4 | M.3
  Bottom 0.152: v31.93,34.11 v34.46,36.64 v39.82,42 | v107.09,48.17 107.09,49.72 v116.69,59.31 | X1.21 76.61,56.74 76.61,36.95 v76.58,36.92 76.63,36.87 76.63,35.79 74.95,34.11 | v71.45,34.11 74.95,34.11 | 74.95,34.11 74.95,21.41 v77.01,19.35
PB6  (via drill 0.25 pad 0.51)
  Top 0.152: 107.52,18.5 106.47,19.55 97.87,19.55 ..3 | ^.4 107.52,17.36 107.52,18.5 | ^.3 107.52,18.5 | F.4 v45.76,25.22 | v46.72,27.28 47.82,27.28 F.3 | 6.4 49.82,41.58 v49.82,39.3 | 52.61,44.48 51.37,43.24 | 51.37,43.24 51.24,43.11 6.4 | N.4 55.38,16.33 54.35,15.29 52.71,15.29 52.11,15.89 52.11,17.2 | N.3 71.49,19.84 88.83,19.84 v89.35,19.32 89.35,16.97 ..4 | N.4 67.97,16.33 N.3 | RIGHT.4 108.9,51.76 | 108.9,51.76 107.12,49.98 94.25,49.98 v91.75,47.47 | ..3 96,19.32 v95.62,19.32 | 24.77,51.89 30.51,51.89 F4.3 33.66,54.06 | 24.77,51.89 F4.4 24.77,51.89 | 52.61,44.48 43.03,54.06 33.66,54.06 | RIGHT.3 116.95,53.87 | 116.95,53.87 114.97,51.89 RIGHT.4 | 6.3 53.3,45.17 52.61,44.48 | 52.11,17.2 52.11,17.78 | 52.11,17.78 52.11,18.25 V.3 52.11,17.78 | 52.11,17.2 v45.48,17.2 44.6,16.33 V.4 | X1.19 R7.2 | F4.3 33.66,54.06 | F.4 | V.4 | RIGHT.3 116.95,53.87 | RIGHT.4 108.9,51.76 | 6.3 | 6.4 51.37,43.24 | F.3 | N.4 | N.3 | ..4 | ..3 | ^.4 | ^.3
  Bottom 0.152: v45.48,17.2 45.48,24.93 v45.76,25.22 46.72,26.17 v46.72,27.28 49.82,30.39 v49.82,39.3 | 90.2,46.41 90.69,46.41 v91.75,47.47 | X1.19 72.33,58.49 72.33,60.38 72.97,61.02 76.26,61.02 77.05,60.23 77.05,59.98 78.15,58.88 78.48,58.88 79.55,57.8 79.55,57.06 90.2,46.41 | 90.2,20.17 90.2,46.41 | v95.62,19.32 91.04,19.32 90.2,20.17 | 90.2,20.17 v89.35,19.32
PB7  (via drill 0.25 pad 0.51)
  Top 0.152: /.4 99.77,18.5 /.3 | SPACE.3 90.88,9.61 97.47,16.2 | 97.47,16.2 /.4 | G.4 47.74,25.22 39.98,32.97 34.33,32.97 31.02,36.28 28.57,36.28 | 28.57,36.28 W.3 22.3,36.28 W.4 | G.3 54.64,25.22 48.9,25.22 | 48.9,25.22 G.4 | SPACE.3 68.93,9.34 v61.96,9.34 61.08,8.46 61.08,7.62 | 61.08,7.62 SPACE.4 61.08,7.62 | v58.95,27.88 57.31,27.88 56.94,27.52 | 56.94,27.52 G.3 | O.4 84.53,36.28 O.3 | v65.94,33.25 66.11,33.07 81.32,33.07 O.4 | DOWN.4 117.79,51.76 | 117.79,51.76 116.83,50.8 108.49,50.8 107.32,49.64 94.59,49.64 91.9,46.94 69.98,46.94 | DOWN.4 123.86,51.89 DOWN.3 | 69.98,46.94 69.77,47.15 69.77,48.44 70.55,49.21 70.8,49.21 R8.2 X1.17 | 69.98,46.94 68.25,45.2 7.3 | 60.33,42.99 60.14,42.99 7.4 60.33,42.99 | 60.33,42.99 v61.55,42.99 | W.4 | W.3 28.57,36.28 | DOWN.4 117.79,51.76 | O.4 | 7.3 | G.3 56.94,27.52 | G.4 48.9,25.22 | /.4 97.47,16.2 | /.3 | SPACE.3
  Bottom 0.152: 61.55,33.25 60.83,33.25 58.95,31.36 v58.95,27.88 58.95,12.36 v61.96,9.34 | v65.94,33.25 61.55,33.25 | 61.55,33.25 v61.55,42.99 61.55,48.21 X1.17
PC3
  Top 0.152: X1.7 58.1,58.35 59.11,59.36 59.11,60.4 57.06,62.45 40.01,62.45 RUS.K
PC5  (via drill 0.25 pad 0.51)
  Top 0.152: LSHIFT.4 v117.42,18.37 117.55,18.5 LSHIFT.3 | RSHIFT.3 11.01,19.36 v11.04,19.36 | X1.11 R10.1 | RSHIFT.3 4.2,18.5 RSHIFT.4 | RSHIFT.4 | RSHIFT.3 | LSHIFT.3 | LSHIFT.4
  Bottom 0.152: v11.04,19.36 18.93,19.36 40.17,40.6 46.32,40.6 X1.11 64.47,56.18 68.87,56.18 69.67,56.98 69.67,60.36 70.64,61.33 81.06,61.33 95.6,46.79 95.6,46.41 117.42,24.59 v117.42,18.37
PC6  (via drill 0.25 pad 0.51)
  Top 0.152: CTRL.3 10.79,54.06 | 10.79,54.06 v11.67,54.06 | X1.13 R9.1 | CTRL.4 8.29,51.89 CTRL.3 | CTRL.4 | CTRL.3 10.79,54.06
  Bottom 0.152: X1.13 66.7,56.49 68.67,56.49 69.28,57.1 69.28,57.89 68.38,58.8 33.14,58.8 32.11,59.84 17.45,59.84 v11.67,54.06
PC7  (via drill 0.25 pad 0.51)
  Top 0.152: v11.35,27.24 10.79,27.24 | 10.79,27.24 10.29,27.24 R/L.3 | R/L.4 7.97,25.22 R/L.3 | X1.15 R11.1 | R/L.3 10.79,27.24 | R/L.4
  Bottom 0.152: X1.15 67.28,58.45 62.78,58.45 62.02,57.69 62.02,57.46 46.57,42.01 41.13,42.01 26.36,27.24 v11.35,27.24

### Text on the board
tPlace: rus | pwr on | esc | f1 | f2 | clear | home | ctrl | f3 | f4 | 1 ! | 2 " | 3 # | 4 $ | 5 % | 6 & | 7 ' | 8 ( | 9 ) | 0 | - = | + ; | bksp | tab | linefeed | rus/lat | * : | return | shift | , < | . > | / ? | shift | space | radio 86rk | @alexcp | mini keyboard
bPlace: PA0 | PA1 | PA2 | PA3 | PA4 | PA5 | PA6 | PA7 | PB0 | PB1 | PB2 | PB3 | GND | PC0 | PC1 | PC2 | PC3 | PC4 | PC5 | PC6 | PC7 | PB7 | PB6 | PB5 | PB4 | +5V | radio 86rk | @alexcp | mini keyboard